# Altium schematic sheet SmartCar_Groop7.SchDoc
size A4
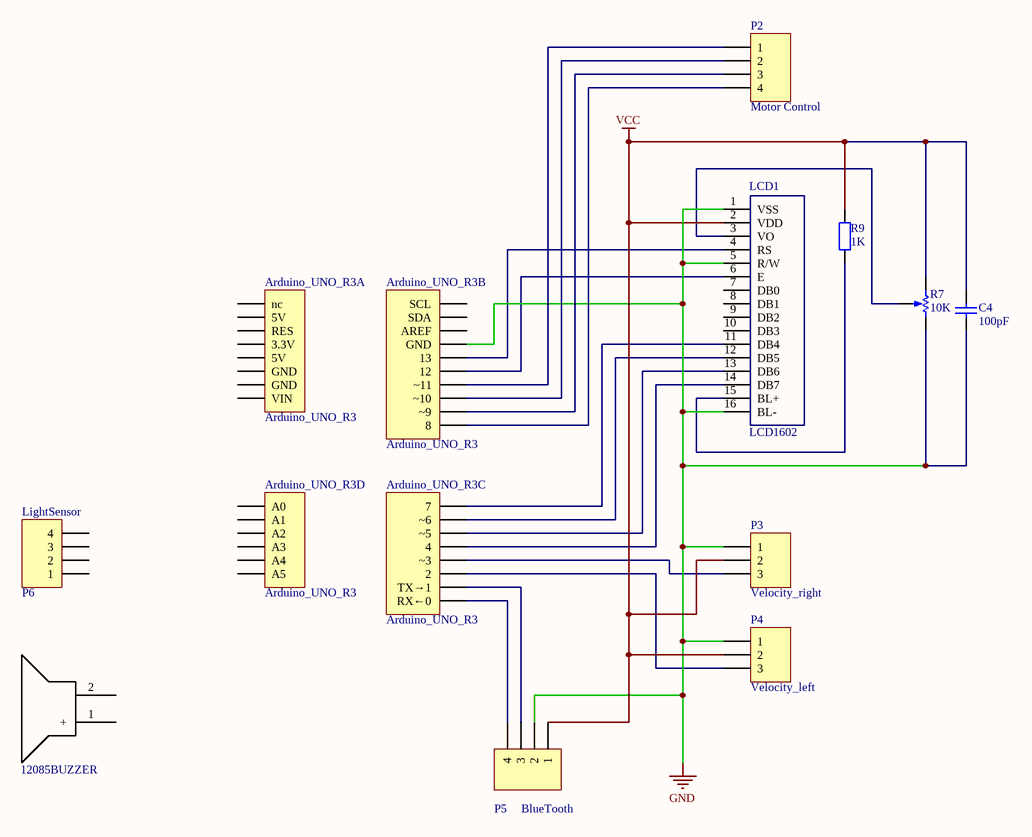
[diagram p0: SmartCar_Groop7.SchDoc]

## Parts
?  12085BUZZER  [BUZ-TH_BD12.0-P6.50-D0.6_SEA-1285F]
Arduino_UNO_R3  Arduino_UNO_R3  [SIP-8]  (parts A,B,C,D of 4)
C4  value 100pF  [RAD-0.1]  (hidden comment: Cap)
LCD1  LCD1602  [1602]
P2  Motor Control  [HDR4X1_A]
P3  Velocity_right  [HDR3X1_A]
P4  Velocity_left  [HDR3X1_A]
P5  BlueTooth  [HDR4X1_A]
P6  LightSensor  [HDR4X1_A]
R7  value 10K  [VR_A1]  (hidden comment: RPot)
R9  value 1K  [AXIAL-0.4]  (hidden comment: Res1)

## Nets
GND: Arduino_UNO_R3.GND C4.1 LCD1.1(VSS) LCD1.5(R/W) LCD1.16(BL-) P3.1 P4.1 P5.2 R7.3(BOT)
VCC: C4.2 LCD1.2(VDD) P3.2 P4.2 P5.1 R7.1(TOP) R9.2
NetArduino_UNO_R3_1: Arduino_UNO_R3.1(RX←0) P5.4
NetArduino_UNO_R3_2: Arduino_UNO_R3.2(TX→1) P5.3
NetArduino_UNO_R3_2: Arduino_UNO_R3.2 P4.3  [a separate net that carries the same name]
NetArduino_UNO_R3_3: Arduino_UNO_R3.3(~3) P3.3
NetArduino_UNO_R3_7: Arduino_UNO_R3.7 LCD1.11(DB4)
NetArduino_UNO_R3_8: Arduino_UNO_R3.8(nc) P2.4
NetArduino_UNO_R3_9: Arduino_UNO_R3.9(~9) P2.3
NetArduino_UNO_R3_10: Arduino_UNO_R3.10(~10) P2.2
NetArduino_UNO_R3_11: Arduino_UNO_R3.11(~11) P2.1
NetArduino_UNO_R3_12: Arduino_UNO_R3.12 LCD1.6(E)
NetArduino_UNO_R3_13: Arduino_UNO_R3.13 LCD1.4(RS)
NetArduino_UNO_R3_54: Arduino_UNO_R3.54(4) LCD1.14(DB7)
NetArduino_UNO_R3_~5: Arduino_UNO_R3.~5 LCD1.13(DB6)
NetArduino_UNO_R3_~6: Arduino_UNO_R3.~6 LCD1.12(DB5)
NetLCD1_3: LCD1.3(VO) R7.2(TAP)
NetLCD1_15: LCD1.15(BL+) R9.1

Not connected (* = marked no-connect by the designer): ? 1(+) 2; Arduino_UNO_R3 3.3V 5V 5V2(5V) A0 A1 A2 A3 A4 A5 AREF GND2(GND) GND3(GND) RES SCL SDA VIN; LCD1 7(DB0) 8(DB1) 9(DB2) 10(DB3); P6 1 2 3 4

## Library data of the parts
? = 12085BUZZER: 12mm*8.5mmBUZZER
C4 = Cap: Capacitor; Published: 8-Jun-2000; PackageReference: RAD-0.3; Publisher: Altium Limited; LatestRevisionDate: 17-Jul-2002; LatestRevisionNote: Re-released for DXP Platform.
P2 P5 P6 = Header 4: 接插件; LatestRevisionDate: 17-Jul-2002; LatestRevisionNote: Re-released for DXP Platform.; Publisher: Altium Limited
P3 P4 = Header 3: 接插件; LatestRevisionDate: 17-Jul-2002; LatestRevisionNote: Re-released for DXP Platform.; Publisher: Altium Limited
R7 = RPot: 精密可调电阻; Sim Note: Enter the Resistance value and the set point into parameter fields.; Set Position: 0.5; Published: 8-Jun-2000; LatestRevisionDate: 17-Jul-2002; LatestRevisionNote: Re-released for DXP Platform.; PackageReference: VR5; Publisher: Altium Limited
R9 = Res1: 贴片电阻; Published: 8-Jun-2000; LatestRevisionDate: 17-Jul-2002; LatestRevisionNote: Re-released for DXP Platform.; PackageReference: AXIAL-0.4; Publisher: Altium Limited
Arduino_UNO_R3 = Arduino_UNO_R3: LatestRevisionDate: 17-Jul-2002; LatestRevisionNote: Re-released for DXP Platform.; Publisher: Altium Limited